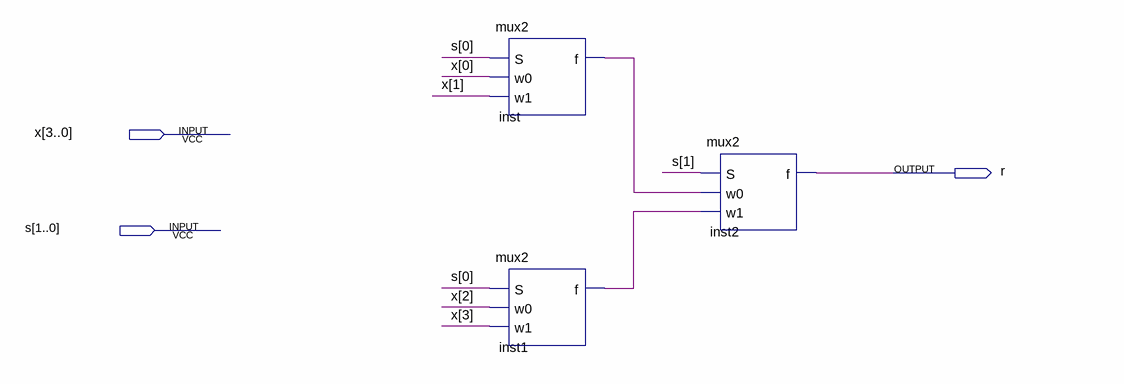
[diagram p0: schematic sheet]
// Quartus schematic mux4.bdf as structural Verilog: 3 symbols, 3 pins
module mux4 (
  input  [3:0] x,
  input  [1:0] s,
  output r
);

  wire inst1_f, inst_f;

  mux2 inst (.S(s[0]), .w0(x[0]), .w1(x[1]), .f(inst_f));
  mux2 inst1 (.S(s[0]), .w0(x[2]), .w1(x[3]), .f(inst1_f));
  mux2 inst2 (.S(s[1]), .w0(inst_f), .w1(inst1_f), .f(r));
endmodule
